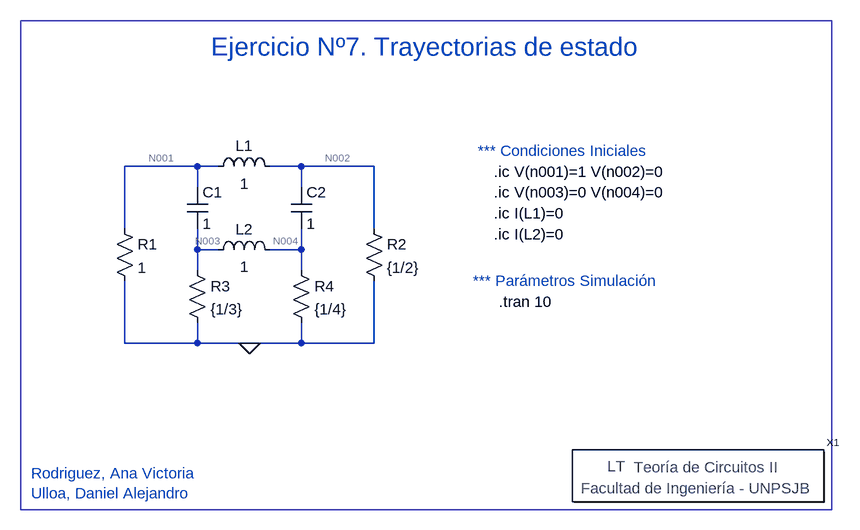
[diagram p0: schematic 07.asc]
07.asc, the LTspice schematic file:
Version 4
SHEET 1 1188 1140
WIRE 208 608 96 608
WIRE 240 608 208 608
WIRE 368 608 320 608
WIRE 480 608 368 608
WIRE 208 640 208 608
WIRE 368 640 368 608
WIRE 96 704 96 608
WIRE 480 704 480 608
WIRE 208 736 208 704
WIRE 240 736 208 736
WIRE 368 736 368 704
WIRE 368 736 320 736
WIRE 208 768 208 736
WIRE 368 768 368 736
WIRE 96 880 96 784
WIRE 208 880 208 848
WIRE 208 880 96 880
WIRE 288 880 208 880
WIRE 368 880 368 848
WIRE 368 880 288 880
WIRE 480 880 480 784
WIRE 480 880 368 880
FLAG 288 880 0
SYMBOL res 80 688 R0
SYMATTR InstName R1
SYMATTR Value 1
SYMBOL cap 192 640 R0
SYMATTR InstName C1
SYMATTR Value 1
SYMBOL res 192 752 R0
SYMATTR InstName R3
SYMATTR Value {1/3}
SYMBOL ind 224 624 R270
WINDOW 0 32 56 VTop 2
WINDOW 3 5 56 VBottom 2
SYMATTR InstName L1
SYMATTR Value 1
SYMBOL ind 224 752 R270
WINDOW 0 32 56 VTop 2
WINDOW 3 5 56 VBottom 2
SYMATTR InstName L2
SYMATTR Value 1
SYMBOL cap 352 640 R0
SYMATTR InstName C2
SYMATTR Value 1
SYMBOL res 352 752 R0
SYMATTR InstName R4
SYMATTR Value {1/4}
SYMBOL res 464 688 R0
SYMATTR InstName R2
SYMATTR Value {1/2}
SYMBOL Circuitos2\\Letreros\\Teoría\ de\ Circuitos\ II 976 1088 R0
SYMATTR InstName X1
TEXT 664 616 Left 2 !.ic V(n001)=1 V(n002)=0
TEXT 672 816 Left 2 !.tran 10
TEXT 560 424 Center 4 ;Ejercicio Nº7. Trayectorias de estado
TEXT -48 1080 Left 2 ;Rodriguez, Ana Victoria\nUlloa, Daniel Alejandro
TEXT 640 584 Left 2 ;*** Condiciones Iniciales
TEXT 632 784 Left 2 ;*** Parámetros Simulación
TEXT 664 680 Left 2 !.ic I(L1)=0
TEXT 664 712 Left 2 !.ic I(L2)=0
TEXT 664 648 Left 2 !.ic V(n003)=0 V(n004)=0
RECTANGLE Normal 1184 1136 -64 384

The netlist it stands for:
* 07.asc
R1 N001 0 1
C1 N001 N003 1
R3 N003 0 {1/3}
L1 N001 N002 1
L2 N003 N004 1
C2 N002 N004 1
R4 N004 0 {1/4}
R2 N002 0 {1/2}
XX1 Teoría de Circuitos II
.ic V(n001)=1 V(n002)=0
.tran 10
* Ejercicio Nº7. Trayectorias de estado
* Rodriguez, Ana Victoria
* Ulloa, Daniel Alejandro
* *** Condiciones Iniciales
* *** Parámetros Simulación
.ic I(L1)=0
.ic I(L2)=0
.ic V(n003)=0 V(n004)=0
.backanno
.end